# Altium schematic sheet SMDRI127-330MT1_SMDRI127-330MT.schdoc
size 127 x 99 mm
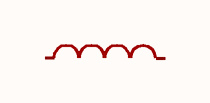
[diagram p0: SMDRI127-330MT1_SMDRI127-330MT.schdoc]

## Parts
L?  33uH  [IND-SMD_L12.3-W12.3]  (value not drawn)

## Nets

Not connected (* = marked no-connect by the designer): L? 1 2

## Library data of the parts
L? = SMDRI127-330MT: Manufacturer: SXN(顺翔诺); Add into BOM: yes; Tolerance: ±20%; Current Rating: 3A; Current - Saturation(Isat): 5.5A; DC Resistance(DCR): 65mΩ; Type: Magnetic Shielded Inductor; Symbol: SMDRI127-330MT; Device: SMDRI127-330MT; LCSC Part Name: 33uH ±20% 5.5A; Supplier Part: C9400; Manufacturer Part: SMDRI127-330MT; Supplier Footprint: SMD,12.3x12.3mm; JLCPCB Part Class: Extended Part; Datasheet: https://item.szlcsc.com/datasheet/SMDRI127-330MT/9929.html; Supplier: LCSC; Convert to PCB: yes; Value: 33uH